# Altium project NewBrightCo_2015_Corvette.PrjPcb
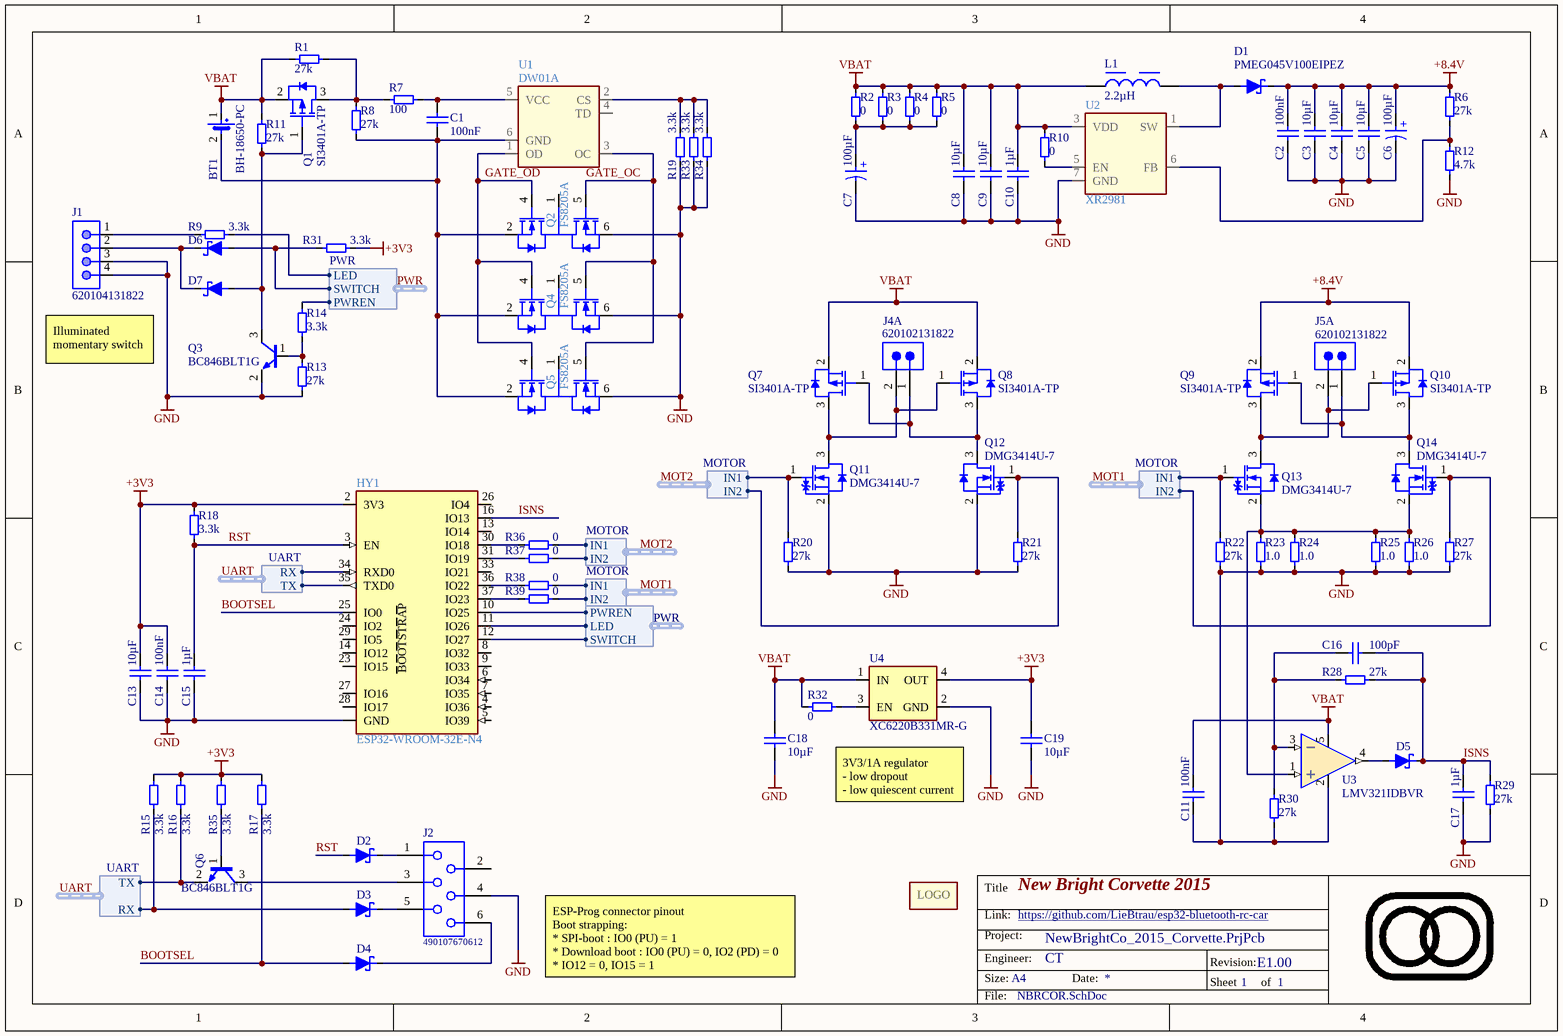
[diagram p0: NBRCOR.SchDoc]
board_name: NBRCOR; Project_link: https://github.com/LieBtrau/esp32-bluetooth-rc-car; project_revision: E1.00
1 sheet, 90 parts. Net scope: global (net labels, ports and power ports of the same name join across sheets).
Board file: NBRCOR.PcbDoc

## Sheet NBRCOR.SchDoc: New Bright Corvette 2015
size A4; Engineer: CT; SheetNumber: 1; SheetTotal: 1; SPICEModelCacheMNSAWVXE: <root> / <DocumentId>MNSAWVXE</DocumentId> / </root>

### Parts
BT1  BH-18650-PC  [BH-18650-PC-Footprint-1]
C1  value 100nF  [0603-C-N]  (hidden comment: Capacitor 100nF +/-10% 25V X7R 0603)
C2  value 100nF  [0603-C-N]  (hidden comment: Capacitor 100nF +/-10% 25V X7R 0603)
C3  value 10µF  [0805-C-N]  (hidden comment: Capacitor 10µF +/-10% 10V X7R 0805)
C4  value 10µF  [0805-C-N]  (hidden comment: Capacitor 10µF +/-10% 10V X7R 0805)
C5  value 10µF  [0805-C-N]  (hidden comment: Capacitor 10µF +/-10% 10V X7R 0805)
C6  Capacitance: 100µF  [WCAP-PTG5_D8H11.5]  (hidden comment: 870025374001)
C7  Capacitance: 100µF  [WCAP-PTG5_D8H11.5]  (hidden comment: 870025374001)
C8  value 10µF  [0805-C-N]  (hidden comment: Capacitor 10µF +/-10% 10V X7R 0805)
C9  value 10µF  [0805-C-N]  (hidden comment: Capacitor 10µF +/-10% 10V X7R 0805)
C10  value 1µF  [0805-C-N]  (hidden comment: Capacitor 1µF +/-10% 10V X7R 0805)
C11  value 100nF  [0603-C-N]  (hidden comment: Capacitor 100nF +/-10% 25V X7R 0603)
C13  value 10µF  [0805-C-N]  (hidden comment: Capacitor 10µF +/-10% 10V X7R 0805)
C14  value 100nF  [0603-C-N]  (hidden comment: Capacitor 100nF +/-10% 25V X7R 0603)
C15  value 1µF  [0805-C-N]  (hidden comment: Capacitor 1µF +/-10% 10V X7R 0805)
C16  value 100pF  [0603-C-N]  (hidden comment: Capacitor 100pF +/-5% 16V NP0 0603)
C17  value 1µF  [0805-C-N]  (hidden comment: Capacitor 1µF +/-10% 10V X7R 0805)
C18  value 10µF  [0805-C-N]  (hidden comment: Capacitor 10µF +/-10% 10V X7R 0805)
C19  value 10µF  [0805-C-N]  (hidden comment: Capacitor 10µF +/-10% 10V X7R 0805)
D1  PMEG045V100EIPEZ  [PMEG045V100EIPEZ-Footprint-1]
D2  1PS79SB30,115  [FP-SOD523-MFG]  (value not drawn)
D3  1PS79SB30,115  [FP-SOD523-MFG]  (value not drawn)
D4  1PS79SB30,115  [FP-SOD523-MFG]  (value not drawn)
D5  1PS79SB30,115  [FP-SOD523-MFG]  (value not drawn)
D6  1PS79SB30,115  [FP-SOD523-MFG]  (value not drawn)
D7  1PS79SB30,115  [FP-SOD523-MFG]  (value not drawn)
HY1  ESP32-WROOM-32E-N4  [FP-ESP32-WROOM-32E_4MB-MFG]
J1  620104131822  [620104131822]
J2  490107670612  [490107670612_Debugging Application]  (no BOM)
J4  620102131822  [620102131822]  (part A of 2)
J5  620102131822  [620102131822]  (part A of 2)
L1  Inductance: 2.2µH  [WE-LHMI_7050]  (hidden comment: 74437349022)
M1  Logo  [LOGO_9x6mm]  (value not drawn)  (no BOM)
Q1  SI3401A-TP  [SOT-23-3-N]
Q2  FS8205A  [TSSOP8]
Q3  BC846BLT1G  [SOT-23-3-N]
Q4  FS8205A  [TSSOP8]
Q5  FS8205A  [TSSOP8]
Q6  BC846BLT1G  [SOT-23-3-N]
Q7  SI3401A-TP  [SOT-23-3-N]
Q8  SI3401A-TP  [SOT-23-3-N]
Q9  SI3401A-TP  [SOT-23-3-N]
Q10  SI3401A-TP  [SOT-23-3-N]
Q11  DMG3414U-7  [SOT-23-3-N]
Q12  DMG3414U-7  [SOT-23-3-N]
Q13  DMG3414U-7  [SOT-23-3-N]
Q14  DMG3414U-7  [SOT-23-3-N]
R1  value 27k  [0603-R-N]  (hidden comment: Resistor 27K +/-1% 0.1W 0603)
R2  value 0  [0603-R-N]  (hidden comment: Jumper 0R <50 mOhm 1A 0603)
R3  value 0  [0603-R-N]  (hidden comment: Jumper 0R <50 mOhm 1A 0603)
R4  value 0  [0603-R-N]  (hidden comment: Jumper 0R <50 mOhm 1A 0603)
R5  value 0  [0603-R-N]  (hidden comment: Jumper 0R <50 mOhm 1A 0603)
R6  value 27k  [0603-R-N]  (hidden comment: Resistor 27K +/-1% 0.1W 0603)
R7  value 100  [0603-R-N]  (hidden comment: Resistor 100R +/-1% 50V 0603)
R8  value 27k  [0603-R-N]  (hidden comment: Resistor 27K +/-1% 0.1W 0603)
R9  value 3.3k  [0603-R-N]  (hidden comment: Resistor 3.3k +/-1% 50V 0603)
R10  value 0  [0603-R-N]  (hidden comment: Jumper 0R <50 mOhm 1A 0603)
R11  value 27k  [0603-R-N]  (hidden comment: Resistor 27K +/-1% 0.1W 0603)
R12  value 4.7k  [0603-R-N]  (hidden comment: Resistor 4.7k +/-1% 50V 0603)
R13  value 27k  [0603-R-N]  (hidden comment: Resistor 27K +/-1% 0.1W 0603)
R14  value 3.3k  [0603-R-N]  (hidden comment: Resistor 3.3k +/-1% 50V 0603)
R15  value 3.3k  [0603-R-N]  (hidden comment: Resistor 3.3k +/-1% 50V 0603)
R16  value 3.3k  [0603-R-N]  (hidden comment: Resistor 3.3k +/-1% 50V 0603)
R17  value 3.3k  [0603-R-N]  (hidden comment: Resistor 3.3k +/-1% 50V 0603)
R18  value 3.3k  [0603-R-N]  (hidden comment: Resistor 3.3k +/-1% 50V 0603)
R19  value 3.3k  [0603-R-N]  (hidden comment: Resistor 3.3k +/-1% 50V 0603)
R20  value 27k  [0603-R-N]  (hidden comment: Resistor 27K +/-1% 0.1W 0603)
R21  value 27k  [0603-R-N]  (hidden comment: Resistor 27K +/-1% 0.1W 0603)
R22  value 27k  [0603-R-N]  (hidden comment: Resistor 27K +/-1% 0.1W 0603)
R23  value 1.0  [0603-R-N]  (hidden comment: Resistor 1.0R +/-1% 0.1W 0603)
R24  value 1.0  [0603-R-N]  (hidden comment: Resistor 1.0R +/-1% 0.1W 0603)
R25  value 1.0  [0603-R-N]  (hidden comment: Resistor 1.0R +/-1% 0.1W 0603)
R26  value 1.0  [0603-R-N]  (hidden comment: Resistor 1.0R +/-1% 0.1W 0603)
R27  value 27k  [0603-R-N]  (hidden comment: Resistor 27K +/-1% 0.1W 0603)
R28  value 27k  [0603-R-N]  (hidden comment: Resistor 27K +/-1% 0.1W 0603)
R29  value 27k  [0603-R-N]  (hidden comment: Resistor 27K +/-1% 0.1W 0603)
R30  value 27k  [0603-R-N]  (hidden comment: Resistor 27K +/-1% 0.1W 0603)
R31  value 3.3k  [0603-R-N]  (hidden comment: Resistor 3.3k +/-1% 50V 0603)
R32  value 0  [0603-R-N]  (hidden comment: Jumper 0R <50 mOhm 1A 0603)
R33  value 3.3k  [0603-R-N]  (hidden comment: Resistor 3.3k +/-1% 50V 0603)
R34  value 3.3k  [0603-R-N]  (hidden comment: Resistor 3.3k +/-1% 50V 0603)
R35  value 3.3k  [0603-R-N]  (hidden comment: Resistor 3.3k +/-1% 50V 0603)
R36  value 0  [0603-R-N]  (hidden comment: Jumper 0R <50 mOhm 1A 0603)
R37  value 0  [0603-R-N]  (hidden comment: Jumper 0R <50 mOhm 1A 0603)
R38  value 0  [0603-R-N]  (hidden comment: Jumper 0R <50 mOhm 1A 0603)
R39  value 0  [0603-R-N]  (hidden comment: Jumper 0R <50 mOhm 1A 0603)
U1  DW01A  [SOT-23-6]
U2  XR2981  [SOIC8_N_EP]
U3  LMV321IDBVR  [SOT25-N]
U4  XC6220B331MR-G  [SOT25-N]

### Harnesses
UART: RX, TX
MOTOR: IN1, IN2
PWR: LED, SWITCH, PWREN

### Nets
+3V3: C13.2 C14.2 C19.1 HY1.2(3V3) R15.2 R16.2 R17.2 R18.2 R31.1 R35.2 U4.4(OUT)
+8.4V: C2.1 C3.2 C4.2 C5.2 C6.1(P) D1.1(K) Q9.2(SOURCE) Q10.2(SOURCE) R6.2
GND: C2.2 C3.1 C4.1 C5.1 C6.2(N) C7.2(N) C8.1 C9.1 C10.1 C11.2 C13.1 C14.1 C15.1 C17.1 C18.2 C19.2 HY1.1(GND) J1.3 J1.4 J2.4 Q2.6(S2) Q3.2(E) Q4.6(S2) Q5.6(S2) Q11.2(S) Q12.2(S) R12.1 R13.1 R19.1 R20.1 R21.1 R22.1 R23.1 R24.1 R25.1 R26.1 R27.1 R29.1 R30.2 R33.1 R34.1 U2.7(GND) U3.2(V-) U4.2(GND)
VBAT: BT1.1(+) C8.2 C9.2 C10.2 C11.1 C18.1 L1.2 Q1.2(SOURCE) Q7.2(SOURCE) Q8.2(SOURCE) R1.2 R2.2 R3.2 R4.2 R5.2 R10.2 R11.2 R32.1 U2.3(VDD) U3.5(V+) U4.1(IN)
BOOTSEL: D4.2(A) HY1.25(IO0) R17.1
GATE_OC: Q2.5(G2) Q4.5(G2) Q5.5(G2) U1.3(OC)
GATE_OD: Q2.4(G1) Q4.4(G1) Q5.4(G1) U1.1(OD)
ISNS: C16.2 C17.2 D5.1(K) HY1.16(IO13) R28.1 R29.2
MOT1.IN1: Q13.1(G) R22.2 R38.1 ; harness MOTOR.IN1
MOT1.IN2: Q14.1(G) R27.2 R39.1 ; harness MOTOR.IN2
MOT2.IN1: Q11.1(G) R20.2 R36.1 ; harness MOTOR.IN1
MOT2.IN2: Q12.1(G) R21.2 R37.1 ; harness MOTOR.IN2
PWR.LED: HY1.11(IO26) R9.2 ; harness PWR.LED
PWR.PWREN: HY1.10(IO25) R14.2 ; harness PWR.PWREN
PWR.SWITCH: D6.2(A) HY1.12(IO27) R31.2 ; harness PWR.SWITCH
RST: C15.2 D2.2(A) HY1.3(EN) R18.1
UART.RX: D3.2(A) HY1.34(RXD0) R15.1 ; harness UART.RX
UART.TX: HY1.35(TXD0) Q6.2(E) R16.1 ; harness UART.TX
NetBT1_2: BT1.2(-) C1.2 Q2.2(S1) Q4.2(S1) Q5.2(S1) R8.2 U1.6(GND)
NetC1_1: C1.1 R7.2 U1.5(VCC)
NetC7_1: C7.1(P) R2.1 R3.1 R4.1 R5.1
NetC16_1: C16.1 R28.2 R30.1 U3.3(IN-)
NetD1_2: D1.2(A) L1.1 U2.1(SW)
NetD2_1: D2.1(K) J2.1
NetD3_1: D3.1(K) J2.5
NetD4_1: D4.1(K) J2.6
NetD5_2: D5.2(A) U3.4(1OUT)
NetD6_1: D6.1(K) D7.1(K) J1.2
NetD7_2: D7.2(A) Q1.1(GATE) Q3.3(C) R11.1
NetHY1_30: HY1.30(IO18) R36.2
NetHY1_31: HY1.31(IO19) R37.2
NetHY1_36: HY1.36(IO22) R38.2
NetHY1_37: HY1.37(IO23) R39.2
NetJ1_1: J1.1 R9.1
NetJ2_3: J2.3 Q6.3(C)
NetJ4_1: J4.1 Q7.1(GATE) Q8.3(DRAIN) Q12.3(D)
NetJ4_2: J4.2 Q7.3(DRAIN) Q8.1(GATE) Q11.3(D)
NetJ5_1: J5.1 Q9.1(GATE) Q10.3(DRAIN) Q14.3(D)
NetJ5_2: J5.2 Q9.3(DRAIN) Q10.1(GATE) Q13.3(D)
NetQ1_3: Q1.3(DRAIN) R1.1 R7.1 R8.1
NetQ3_1: Q3.1(B) R13.2 R14.1
NetQ6_1: Q6.1(B) R35.1
NetQ13_2: Q13.2(S) Q14.2(S) R23.2 R24.2 R25.2 R26.2 U3.1(IN+)
NetR6_1: R6.1 R12.2 U2.6(FB)
NetR10_1: R10.1 U2.5(EN)
NetR19_2: R19.2 R33.2 R34.2 U1.2(CS)
NetR32_2: R32.2 U4.3(EN)

Not connected (* = marked no-connect by the designer): HY1 4(IO36) 5(IO39) 6(IO34) 7(IO35) 8(IO32) 9(IO33) 13(IO14) 14(IO12) 23(IO15) 24(IO2) 26(IO4) 27(IO16) 28(IO17) 29(IO5) 33(IO21); J2 2; Q2 1(D12); Q4 1(D12); Q5 1(D12); U1 4(TD)

### Notes on the sheet
- Illuminated momentary switch
- 3V3/1A regulator
  - low dropout
  - low quiescent current
- ESP-Prog connector pinout
  Boot strapping:
  * SPI-boot : IO0 (PU) = 1
  * Download boot : IO0 (PU) = 0, IO2 (PD) = 0
  * IO12 = 0, IO15 = 1
- Title
- Link:
- Size:
- Project:
- Engineer:
- A4
- Date:
- Revision:
- Sheet
- of
- File:
- (in symbol CMP-00003-4) BOOTSTRAP
- (in symbol CMP-098-000013-3) +
- (in symbol Logo) LOGO

### Library data of the parts
BT1 = CMP-001-0034-5: Battery Holder 18650 Pc Pin; Number of Cells: 1; Termination: PC Pin; Min Operating Temperature: -40°C; Series: -; RoHS Compliant: Yes; Max Operating Temperature: 180°C; Mounting Technology: Through Hole,PCB; ComponentLink1Description: AliExpress alternative source; ComponentLink1URL: https://www.aliexpress.com/item/33037738446.html
C1 C2 C11 C14 = CMP-072-000593-11: WCAP-CSGP Multilayer Ceramic Chip Capacitor, General Purpose, size 0603, X7R, 100nF, 25VDC; Capacitor Type: MLCC; Tolerance: 10%; Dissipation Factor: 3.5%; Technical Reference: X7R0603104K025DFCT20000; Insulation Resistance: 5GO; Length: 1.6mm; Dielectric: X7R; Height: 0.8mm; Pins: 2; Min Operating Temperature: -55°C; Usage: General Purpose; Mounting Technology: SMT; Case/Package: 0603; Width: 0.8mm; Max Operating Temperature: 125°C; Voltage Rating: 25V; Design Item ID: 885012206071R; ComponentLink1URL: https://www.we-online.com/redexpert/article/885012206071R?ad; ComponentLink2URL: https://www.we-online.com/redexpert/spec/885012206071R?ad; Packaging: Tape and Reel; ComponentLink1Description: Website Link; Match Code: WCAP-CSGP; ComponentLink2Description: Datasheet Link; Source: WCAP-CSGP.SchLib
C3-C5 C8 C9 C13 C18 C19 = CMP-072-000663-12: WCAP-CSGP Multilayer Ceramic Chip Capacitor, General Purpose, size 0805, X7R, 10µF, 10VDC; Technical Reference: X7R0805106K010DFCT10000; Tolerance: 10%; Capacitor Type: MLCC; Insulation Resistance: 0.01GO; Length: 2mm; ComponentLink2URL: https://www.we-online.com/redexpert/spec/885012207026?ad; Packaging: Tape and Reel; ComponentLink1Description: Website Link; Design Item ID: 885012207026; Source: WCAP-CSGP.SchLib; ComponentLink2Description: Datasheet Link; Pins: 2; Usage: General Purpose; Voltage Rating: 10V; Height: 1.25mm; ComponentLink1URL: https://www.we-online.com/redexpert/article/885012207026?ad; Dielectric: X7R; Mounting Technology: SMT; Dissipation Factor: 10%; Min Operating Temperature: -55°C; Width: 1.25mm; Max Operating Temperature: 125°C; Case/Package: 0805; Match Code: WCAP-CSGP; JLCPCB Part #: C15850
C6 C7 = CMP-098-000013-3: WCAP-PTG5 Aluminum Polymer Capacitor, Radial THT, D8 x H11.5mm, 100µF, 16V; Manufacturer: Wurth Elektronik; Leakage Current: 160µA; Capacitance Tolerance: +/-20%; Dissipation Factor: 8%; ESR: 12mO; Ripple Current: 4800mA; Technical Reference: PTEE115101M016DSPA7B000; Endurance: 2000h; ComponentLink1URL: https://www.we-online.com/redexpert/article/870025374001?ad; ComponentLink2URL: https://www.we-online.com/redexpert/spec/870025374001?ad; Mount: Through Hole; Height: 11.5mm; Diameter: 8mm; Pin Count: 2; Manufacturer Part Number: 870025374001; ComponentLink1Description: Website Link; Design Item ID: 870025374001; Operating Temperature Min: -55°C; Packaging: Ammo Pack; Component Type: Standard; Rated Voltage (DC): 16V; Operating Temperature Max: 105°C; Match Code: WCAP-PTG5; Category: Aluminum Polymer Capacitors; ComponentLink2Description: Datasheet Link; Source: WCAP-PTG5.SchLib
C10 C15 C17 = CMP-072-000659-13: WCAP-CSGP Multilayer Ceramic Chip Capacitor, General Purpose, size 0805, X7R, 1µF, 10VDC; Dissipation Factor: 5%; Technical Reference: X7R0805105K010DFCT10000; Tolerance: 10%; Capacitor Type: MLCC; Insulation Resistance: 0.5GO; Source: WCAP-CSGP.SchLib; Usage: General Purpose; JLCPCB Part #: C28323; Width: 1.25mm; Mounting Technology: SMT; ComponentLink1URL: https://www.we-online.com/redexpert/article/885012207022?ad; Max Operating Temperature: 125°C; ComponentLink2Description: Datasheet Link; Min Operating Temperature: -55°C; Match Code: WCAP-CSGP; Case/Package: 0805; ComponentLink2URL: https://www.we-online.com/redexpert/spec/885012207022?ad; Voltage Rating: 10V; ComponentLink1Description: Website Link; Length: 2mm; Height: 1.25mm; Pins: 2; Dielectric: X7R; Packaging: Tape and Reel; Design Item ID: 885012207022
C16 = CMP-072-000094-12: WCAP-CSGP Multilayer Ceramic Chip Capacitor, General Purpose, size 0603, NP0, 100pF, 16VDC; Insulation Resistance: 10GO; Capacitor Type: MLCC; Q Factor: 1000; Tolerance: 5%; Technical Reference: NP00603101J016DFCT10000; Match Code: WCAP-CSGP; Pins: 2; Height: 0.8mm; ComponentLink2Description: Datasheet Link; Source: WCAP-CSGP.SchLib; Mounting Technology: SMT; Packaging: Tape and Reel; Design Item ID: 885012006023; Length: 1.6mm; Case/Package: 0603; Max Operating Temperature: 125°C; Width: 0.8mm; ComponentLink1URL: https://www.we-online.com/redexpert/article/885012006023?ad; Min Operating Temperature: -55°C; ComponentLink2URL: https://www.we-online.com/redexpert/spec/885012006023?ad; Voltage Rating: 16V; ComponentLink1Description: Website Link; Dielectric: NP0; Usage: General Purpose
D1 = CMP-004-00051-2: Schottky Rectifier, 45V, 10A, Sot-1289 Rohs Compliant: Yes; Forward Voltage: 540 mV @ 10 A; Forward Current: 10A; Case/Package: TO-277, 3-PowerFDN, SOT1289B; Max Reverse Voltage (DC): 45V
D2-D7 = CMP-004-00048-3: VR=40V IF=200mA 20pF; Forward Voltage: 600 mV @ 200 mA; Forward Current: 200mA; Max Repetitive Reverse Voltage (Vrrm): 40V; Case/Package: SOD-523; RoHS Compliant: Yes
HY1 = CMP-00003-4: WiFi-Modul 802.11/BT 2, 4-2, 5GHz 150Mb/s; pin to pad: 1>1+15+38+39.1+39.2+39.3+39.4+39.5+39.6+39.7+39.8+39.9
J1 = CMP-047-000042-2: WR-WTB SMT Male Horizontal Shrouded Header, pitch 2mm, 4p; Withstanding Voltage: 800VAC; Contact Resistance: 20mOhm; Pin Number: 4; Working Voltage: 100VAC; Rated Current: 2A; Part Number: 620104131822; Operating Temperature: -25 to +85degC; Publisher: Wurth Elektronik; ComponentLink2URL: https://www.we-online.com/catalog/datasheet/620104131822.pdf; Gender: Male; Published Date: January 2020; Pitch: 2mm; Design Item ID: 620104131822; Component Type: Standard; Pin Count: 4; Type: Horizontal; Packaging: Tape and Reel; ComponentLink1Description: Manufacturer; Source: WR-WTB_2.00mm.SchLib; ComponentLink2Description: Datasheet; Mounting Technology: SMT; ComponentLink1URL: http://www.we-online.de
J2 = CMP-002-000028-7: WR-WST REDFIT IDC SKEDD, pitch 2.54mm, 6pins; Contact Resistance max.: 10mOhm; Gender: Transition; Rated Current: 1A; Pin Number: 6; Working Voltage: 100V(AC); Connector Type: Cable,IDC; Design Item ID: 490107670612; Source: WR-WST.SchLib; Packaging: Tube; ComponentLink2Description: Datasheet; Part Number: 490107670612; ComponentLink1Description: Manufacturer; Operating Temperature: -25 to +105degC; Pitch: 2.54mm; ComponentLink1URL: http://www.we-online.de; Published Date: November 2019; Mounting Technology: Press-In; Publisher: Wurth Elektronik; ComponentLink2URL: https://katalog.we-online.com/em/datasheet/490107670612.pdf; RoHS Compliant: Yes; Contact Plating: Gold; Series: REDFIT WR-WST
J4 J5 = CMP-047-000040-8: WR-WTB SMT Male Horizontal Shrouded Header, pitch 2mm, 2p; Rated Current: 2A; Withstanding Voltage: 800VAC; Pin Number: 2; Contact Resistance: 20mOhm; Working Voltage: 100VAC; Part Number: 620102131822; Published Date: January 2020; Pitch: 2mm; Component Type: Standard; Publisher: Wurth Elektronik; Operating Temperature: -25 to +85degC; Design Item ID: 620102131822; Pin Count: 2; Source: WR-WTB_2.00mm.SchLib; ComponentLink2URL: https://www.we-online.com/catalog/datasheet/620102131822.pdf; ComponentLink1Description: Manufacturer; ComponentLink2Description: Datasheet; Mounting Technology: SMT; Type: Horizontal; Packaging: Tape and Reel; ComponentLink1URL: http://www.we-online.de; Gender: Male
L1 = CMP-086-000079-3: WE-LHMI SMT Power Inductor, size 7050, 2.2µH, 9.9A, 12mO; Manufacturer: Wurth Elektronik; Case/Size Code: 7050; Self Resonant Frequency: 30MHz; DC Resistance: 11.2mO; Saturation Current @10%: 10.5A; Saturation Current @30%: 19.1A; ComponentLink2Description: Datasheet Link; ComponentLink1Description: Website Link; Match Code: WE-LHMI; Pin Count: 2; ComponentLink1URL: https://www.we-online.com/redexpert/article/74437349022?ad; Manufacturer Part Number: 74437349022; Height: 4.8mm; Source: WE-LHMI.SchLib; Operating Temperature Min: -40°C; ComponentLink2URL: https://www.we-online.com/redexpert/spec/74437349022?ad; Width: 6.6mm; Design Item ID: 74437349022; DC Resistance Max: 12mO; Performance Rated Current: 9.9A; Component Type: Standard; Mount: Surface Mount; Length: 6.6mm; Category: Shielded Power Inductors; Operating Temperature Max: 125°C; Packaging: Tape and Reel
Q1 Q7-Q10 = CMP-013-00056-5: Trans Mosfet P-ch 30V 4.2A 3-PIN SOT-23 T/r; Rds On Max: 60mR; Max Power Dissipation: 400mW; Transistor Type: PMOS; Input Capacitance: 1.05nF; Vgs(th) (Max) @ Id: -1.3V @ 250µA; Mounting Technology: Surface Mount; Packaging: Cut Tape; Min Operating Temperature: -55°C; Id - Continuous Drain Current: 4.2A; Max Operating Temperature: 150°C; RoHS Compliant: Yes; Vds Max: 30V; Case/Package: SOT-23-3; JLCPCB Part #: C194253; Series: -
Q2 Q4 Q5 = CMP-013-00060-3: Dual common drain NFET for Li-Ion protection; pin to pad: 1>1+8 2>2+3 6>6+7
Q3 Q6 = CMP-013-00048-9: NPN Ic=100mA Vceo=65V hfe=200~450 P=225mW SOT-23; Ic Max: 100mA; Vce Max: 65V; Case/Package: SOT-23-3; Transistor Type: NPN
Q11-Q14 = CMP-013-00054-5: Trans MOSFET N-CH 20V 4.2A Automotive 3-Pin SOT-23 T/R; Element Configuration: Single; Number of Elements: 1; Drain-source On Resistance-Max: 25mR; Input Capacitance: 829.9pF; Transistor Type: NMOS; Rise Time: 8.3ns; Fall Time: 9.6ns; Turn-Off Delay Time: 40.1ns; Max Power Dissipation: 780mW; Gate to Source Voltage (Vgs): 8V; Vgs(th) (Max) @ Id: 900mV @ 250µA; Turn-On Delay Time: 8.1ns; Polarity: N-CHANNEL; Drain to Source Voltage (Vdss): 20V; Height: 1.1mm; Continuous Drain Current (ID): 4.2A; Case/Package: SOT-23-3; Id - Continuous Drain Current: 4.2A; Min Operating Temperature: -55°C; Length: 3mm; Rds On Max: 25mR; Mounting Technology: Surface Mount; Series: -; Drain to Source Resistance: 25mR; Vds Max: 20V; On-State Resistance: 25mR; Packaging: Tape and Reel; Lead Free: Lead Free; Max Operating Temperature: 150°C; Reach SVHC Compliant: Yes; Package Quantity: 3000; Width: 1.4mm; Number of Channels: 1; Pins: 3; Power Dissipation: 780mW; Drain to Source Breakdown Voltage: 20V; Weight: 0.000282oz
R1 R6 R8 R11 R13 R20-R22 R27-R30 = CMP-009-00275-7: Res Thick Film 0603 27K Ohm 1% 0.1W(1/10W) ±100ppm/C Pad SMD Automotive T/R; Max Power Dissipation: 100mW; Usage: General Purpose; Tolerance: 1%; JLCPCB Part #: C22967; Case/Package: 0603
R2-R5 R10 R32 R36-R39 = CMP-009-00006-19: Chip Jumper, Thick Film, Jumper, 0603, 100mW, 1A, 0 Ohm, <50 mOhm; Elements: 1; Tolerance: 50 mOhm; Voltage Rating: 75V; Pins: 2; Usage: Jumper; Min Operating Temperature: -55°C; RoHS Compliant: True; JLCPCB Part #: C21189; Case/Package: 0603; Max Operating Temperature: 155°C; Resistor Type: Thick Film; Power Rating: 100mW; Mounting Technology: SMT; Current Rating: 1A
R7 = CMP-009-00232-11: Chip Resistor, Thick Film, General Purpose, 0603, 63mW, 50V, 100 Ohm, +/-1%; Temperature Coefficient: 100ppm/°C; Tolerance: 1%; Elements: 1; Resistor Type: Thick Film; Usage: General Purpose; Min Operating Temperature: -55°C; Max Operating Temperature: 155°C; JLCPCB Part #: C22775; Mounting Technology: SMT; RoHS Compliant: Yes; Power Rating: 63mW; Voltage Rating: 50V; Pins: 2; Case/Package: 0603
R9 R14-R19 R31 R33-R35 = CMP-009-00243-11: Chip Resistor, Thick Film, General Purpose, 0603, 100mW, 50V, 3.3 kOhm, +/-1%; Tolerance: 1%; Elements: 1; Resistor Type: Thick Film; RoHS Compliant: Yes; Voltage Rating: 50V; Usage: General Purpose; Case/Package: 0603; Pins: 2; Power Rating: 100mW; Mounting Technology: SMT; Min Operating Temperature: -55°C; JLCPCB Part #: C22978; Max Operating Temperature: 155°C
R12 = CMP-009-00031-20: Chip Resistor, Thick Film, General Purpose, 0603, 100mW, 50V, 4.7 kOhm, +/-1%; Tolerance: 1%; Elements: 1; Power Rating: 100mW; JLCPCB Part #: C23162; RoHS Compliant: True; Max Operating Temperature: 155°C; Case/Package: 0603; Min Operating Temperature: -55°C; Resistor Type: Thick Film; Usage: General Purpose; Voltage Rating: 50V; Pins: 2; Mounting Technology: SMT
R23-R26 = CMP-009-00322-2: SMD Chip Resistor, 1 Ohm, ± 1%, 100 mW, 0603 [1608 Metric], Thick Film, Anti-Sulfur; Max Power Dissipation: 100mW; Temperature Coefficient: 100ppm/°C; Min Operating Temperature: -55°C; Tolerance: 1%; RoHS Compliant: Yes; Case/Package: 0603; Max Operating Temperature: 155°C; Number of Terminations: 2; Height: 0.02inch; Length: 0.061inch; Packaging: Cut Tape; Features: Automotive AEC-Q200,Anti-Sulfur; Width: 0.033inch; Series: RCA
U1 = CMP-019-00088-3: Li-Ion protection IC; Over discharge protection: 2.4V
U2 = CMP-002-001560-3: 3.3V~5V Input 24W Output Step-up DC/DC Converter; pin to pad: 1>1+2 3>3+4 7>7+8+9
U3 = CMP-014-00008-4: General Purpose Amplifier 1 Circuit Rail-to-Rail SOT-23-5; Unity Gain Bandwidth Product: 1MHz; Common Mode Rejection Ratio: 50dB; Min Supply Voltage: 2.7V; Output Current: 160mA; Voltage Gain: 100dB; Number of Circuits: 1; Slew Rate: 1V/µs; Input Bias Current: 250nA; Operating Supply Current: 130uA; Input Offset Voltage (Vos): 7mV; Supply Current: 250uA; Max Supply Voltage: 5.5V; Case/Package: SOT-23-5; Mounting Technology: Surface Mount; RoHS Compliant: Yes; Technology: BICMOS; Max Operating Temperature: 125°C; Amplifier Type: GENERAL PURPOSE; Bandwidth: 1MHz; Gain Bandwidth Product: 1MHz; Min Operating Temperature: -40°C; Package Quantity: 1; Lead Free: Lead Free; Number of Channels: 1; Pins: 5; Packaging: Tape and Reel; Series: -; Reach SVHC Compliant: No; Number of Elements: 1; Output Current per Channel: 160mA; Radiation Hardening: No; Number of Amplifiers: 1
U4 = CMP-019-00081-7: Fixed LDO 3.3V, 1%, 1A, Iq 108uA, -40°C to 85°C; pin to pad: 4>5; Max Input Voltage: 6V; Min Input Voltage: 4V; Number of Regulators: 1; Output Current: 1A; Case/Package: SOT-23-5; Output Voltage: 3.3V; Quiescent Current: 108uA; Max Operating Temperature: 85°C; Output Type: Fixed; Accuracy: 1%; Number of Outputs: 1; Min Operating Temperature: -40°C; Mount: SMT

## Assembly variants
A: not fitted R1 R8